# Altium schematic sheet Moo_Top.SchDoc
size A; Date: 7/01/09; Engineer: Alanson Sample & Dan Yeager; Revision: Release
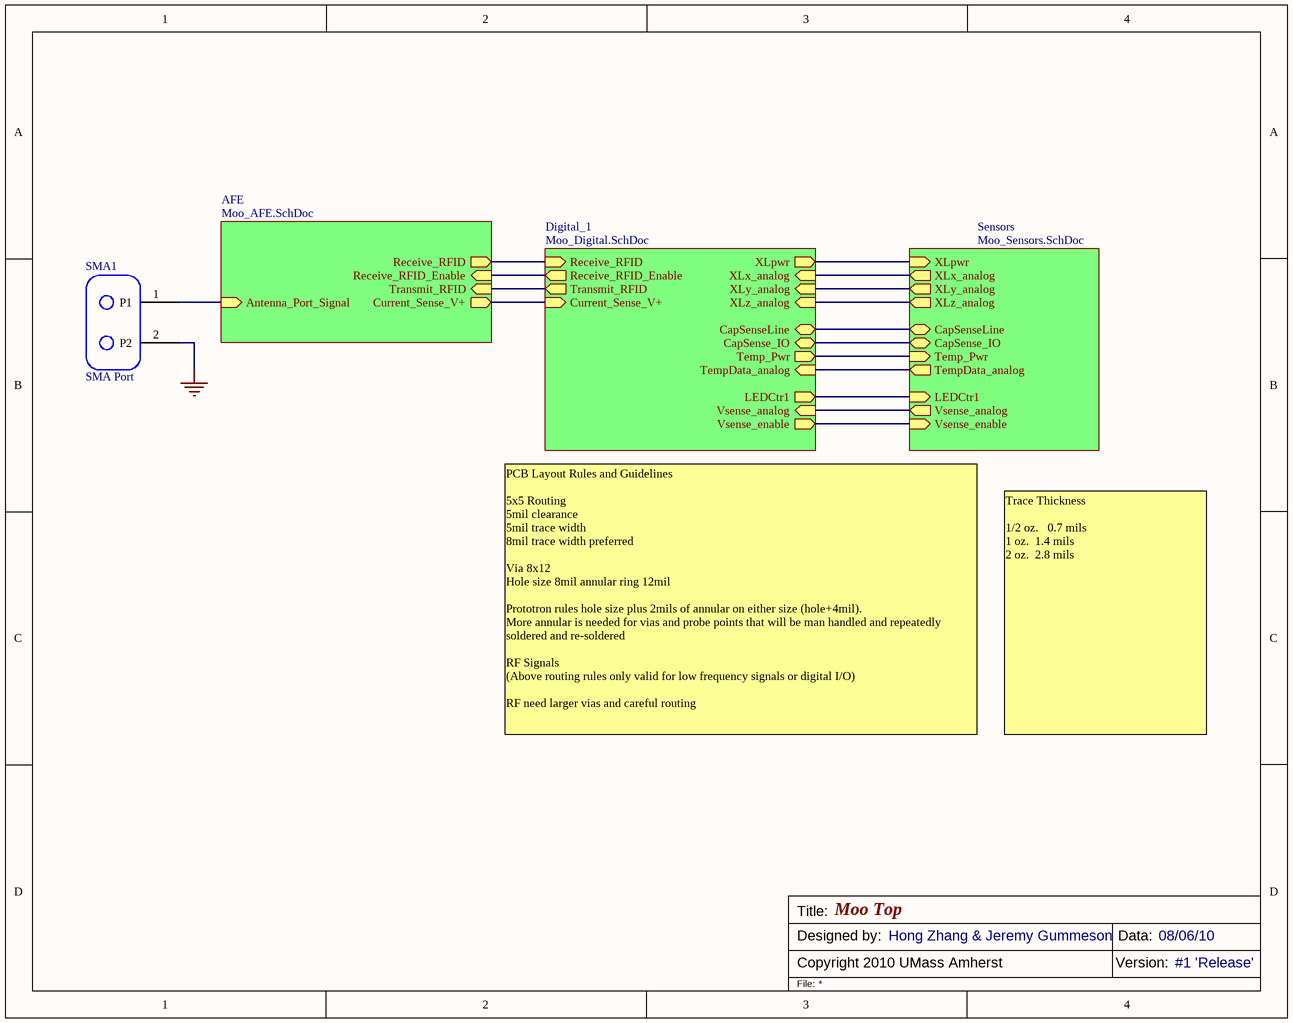
[diagram p0: Moo_Top.SchDoc]

## Parts
SMA1  SMA Port  [SMA Port]

## Sub-sheets
AFE = Moo_AFE.SchDoc: Receive_RFID (out), Receive_RFID_Enable (in), Transmit_RFID (in), Antenna_Port_Signal (in), Current_Sense_V+ (out)
Digital_1 = Moo_Digital.SchDoc: Receive_RFID (in), Receive_RFID_Enable (out), Transmit_RFID (out), XLpwr (out), XLx_analog (in), XLy_analog (in), XLz_analog (in), LEDCtr1 (out), Vsense_analog (in), Temp_Pwr (out), TempData_analog (in), CapSense_IO (bidir), Vsense_enable (out), CapSenseLine (bidir), Current_Sense_V+ (in)
Sensors = Moo_Sensors.SchDoc: XLpwr, XLx_analog (out), XLy_analog (out), XLz_analog (out), TempData_analog (out), Temp_Pwr, LEDCtr1 (in), Vsense_analog (out), CapSense_IO, Vsense_enable (in), CapSenseLine

## Nets
GND: SMA1.2(P2)
NetSMA1_1: SMA1.1(P1) ; sheet AFE/Antenna_Port_Signal
(unnamed): sheet AFE/Receive_RFID, sheet Digital_1/Receive_RFID
(unnamed): sheet AFE/Receive_RFID_Enable, sheet Digital_1/Receive_RFID_Enable
(unnamed): sheet AFE/Transmit_RFID, sheet Digital_1/Transmit_RFID
(unnamed): sheet AFE/Current_Sense_V+, sheet Digital_1/Current_Sense_V+
(unnamed): sheet Sensors/XLpwr, sheet Digital_1/XLpwr
(unnamed): sheet Sensors/XLx_analog, sheet Digital_1/XLx_analog
(unnamed): sheet Sensors/XLy_analog, sheet Digital_1/XLy_analog
(unnamed): sheet Sensors/XLz_analog, sheet Digital_1/XLz_analog
(unnamed): sheet Sensors/TempData_analog, sheet Digital_1/TempData_analog
(unnamed): sheet Sensors/Temp_Pwr, sheet Digital_1/Temp_Pwr
(unnamed): sheet Sensors/LEDCtr1, sheet Digital_1/LEDCtr1
(unnamed): sheet Sensors/Vsense_analog, sheet Digital_1/Vsense_analog
(unnamed): sheet Sensors/CapSense_IO, sheet Digital_1/CapSense_IO
(unnamed): sheet Sensors/Vsense_enable, sheet Digital_1/Vsense_enable
(unnamed): sheet Sensors/CapSenseLine, sheet Digital_1/CapSenseLine

## Notes on the sheet
- PCB Layout Rules and Guidelines
  5x5 Routing
  5mil clearance
  5mil trace width
  8mil trace width preferred
  Via 8x12
  Hole size 8mil annular ring 12mil
  Prototron rules hole size plus 2mils of annular on either size (hole+4mil).
  More annular is needed for vias and probe points that will be man handled and repeatedly soldered and re-soldered
  RF Signals
  (Above routing rules only valid for low frequency signals or digital I/O)
  RF need larger vias and careful routing
- Trace Thickness
  1/2 oz.  	0.7 mils
  1 oz. 	1.4 mils
  2 oz. 	2.8 mils
- Title:
- Copyright 2010 UMass Amherst
- Designed by:
- Moo Top
- Hong Zhang & Jeremy Gummeson
- Version:
- Data:
- 08/06/10
- #1 'Release'
- File:

## Library data of the parts
SMA1 = SMA Port: Two pin SMA connector wisp; Value: Do Not Stuff